# Altium project PokerFaceTestBoard.PrjPcb
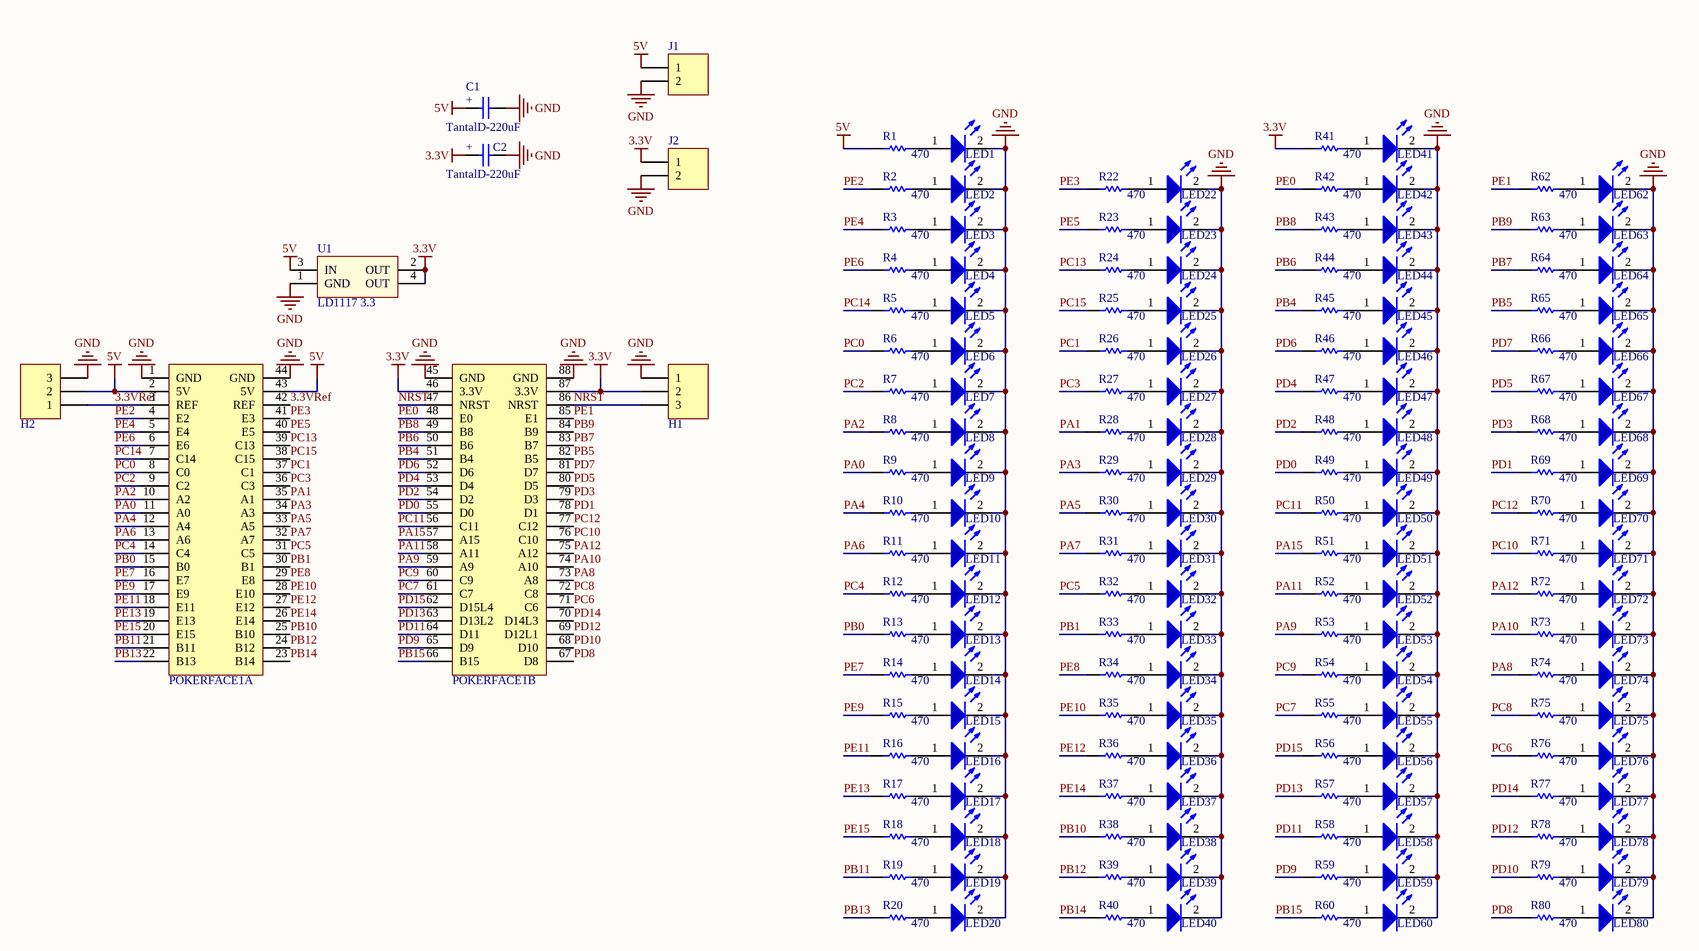
[diagram p0: PokerFaceTestBoard.SchDoc]
1 sheet, 164 parts. Net scope: global (net labels, ports and power ports of the same name join across sheets).
Board file: PokerFaceTestBoard.PcbDoc

## Sheet PokerFaceTestBoard.SchDoc
size A3

### Parts
C1  TantalD-220uF  [MY_CAP_SMD-D]
C2  TantalD-220uF  [MY_CAP_SMD-D]
H1  WE-2.54 mm Pin Header & Jumper 61300311121  [61300311121]  (value not drawn)
H2  WE-2.54 mm Pin Header & Jumper 61300311121  [61300311121]  (value not drawn)
J1  691312510002  [691312510002]  (value not drawn)
J2  691312510002  [691312510002]  (value not drawn)
LED1  150080BS75000  [LED_0805_Blue]  (value not drawn)
LED2  150080BS75000  [LED_0805_Blue]  (value not drawn)
LED3  150080BS75000  [LED_0805_Blue]  (value not drawn)
LED4  150080BS75000  [LED_0805_Blue]  (value not drawn)
LED5  150080BS75000  [LED_0805_Blue]  (value not drawn)
LED6  150080BS75000  [LED_0805_Blue]  (value not drawn)
LED7  150080BS75000  [LED_0805_Blue]  (value not drawn)
LED8  150080BS75000  [LED_0805_Blue]  (value not drawn)
LED9  150080BS75000  [LED_0805_Blue]  (value not drawn)
LED10  150080BS75000  [LED_0805_Blue]  (value not drawn)
LED11  150080BS75000  [LED_0805_Blue]  (value not drawn)
LED12  150080BS75000  [LED_0805_Blue]  (value not drawn)
LED13  150080BS75000  [LED_0805_Blue]  (value not drawn)
LED14  150080BS75000  [LED_0805_Blue]  (value not drawn)
LED15  150080BS75000  [LED_0805_Blue]  (value not drawn)
LED16  150080BS75000  [LED_0805_Blue]  (value not drawn)
LED17  150080BS75000  [LED_0805_Blue]  (value not drawn)
LED18  150080BS75000  [LED_0805_Blue]  (value not drawn)
LED19  150080BS75000  [LED_0805_Blue]  (value not drawn)
LED20  150080BS75000  [LED_0805_Blue]  (value not drawn)
LED22  150080BS75000  [LED_0805_Blue]  (value not drawn)
LED23  150080BS75000  [LED_0805_Blue]  (value not drawn)
LED24  150080BS75000  [LED_0805_Blue]  (value not drawn)
LED25  150080BS75000  [LED_0805_Blue]  (value not drawn)
LED26  150080BS75000  [LED_0805_Blue]  (value not drawn)
LED27  150080BS75000  [LED_0805_Blue]  (value not drawn)
LED28  150080BS75000  [LED_0805_Blue]  (value not drawn)
LED29  150080BS75000  [LED_0805_Blue]  (value not drawn)
LED30  150080BS75000  [LED_0805_Blue]  (value not drawn)
LED31  150080BS75000  [LED_0805_Blue]  (value not drawn)
LED32  150080BS75000  [LED_0805_Blue]  (value not drawn)
LED33  150080BS75000  [LED_0805_Blue]  (value not drawn)
LED34  150080BS75000  [LED_0805_Blue]  (value not drawn)
LED35  150080BS75000  [LED_0805_Blue]  (value not drawn)
LED36  150080BS75000  [LED_0805_Blue]  (value not drawn)
LED37  150080BS75000  [LED_0805_Blue]  (value not drawn)
LED38  150080BS75000  [LED_0805_Blue]  (value not drawn)
LED39  150080BS75000  [LED_0805_Blue]  (value not drawn)
LED40  150080BS75000  [LED_0805_Blue]  (value not drawn)
LED41  150080BS75000  [LED_0805_Blue]  (value not drawn)
LED42  150080BS75000  [LED_0805_Blue]  (value not drawn)
LED43  150080BS75000  [LED_0805_Blue]  (value not drawn)
LED44  150080BS75000  [LED_0805_Blue]  (value not drawn)
LED45  150080BS75000  [LED_0805_Blue]  (value not drawn)
LED46  150080BS75000  [LED_0805_Blue]  (value not drawn)
LED47  150080BS75000  [LED_0805_Blue]  (value not drawn)
LED48  150080BS75000  [LED_0805_Blue]  (value not drawn)
LED49  150080BS75000  [LED_0805_Blue]  (value not drawn)
LED50  150080BS75000  [LED_0805_Blue]  (value not drawn)
LED51  150080BS75000  [LED_0805_Blue]  (value not drawn)
LED52  150080BS75000  [LED_0805_Blue]  (value not drawn)
LED53  150080BS75000  [LED_0805_Blue]  (value not drawn)
LED54  150080BS75000  [LED_0805_Blue]  (value not drawn)
LED55  150080BS75000  [LED_0805_Blue]  (value not drawn)
LED56  150080BS75000  [LED_0805_Blue]  (value not drawn)
LED57  150080BS75000  [LED_0805_Blue]  (value not drawn)
LED58  150080BS75000  [LED_0805_Blue]  (value not drawn)
LED59  150080BS75000  [LED_0805_Blue]  (value not drawn)
LED60  150080BS75000  [LED_0805_Blue]  (value not drawn)
LED62  150080BS75000  [LED_0805_Blue]  (value not drawn)
LED63  150080BS75000  [LED_0805_Blue]  (value not drawn)
LED64  150080BS75000  [LED_0805_Blue]  (value not drawn)
LED65  150080BS75000  [LED_0805_Blue]  (value not drawn)
LED66  150080BS75000  [LED_0805_Blue]  (value not drawn)
LED67  150080BS75000  [LED_0805_Blue]  (value not drawn)
LED68  150080BS75000  [LED_0805_Blue]  (value not drawn)
LED69  150080BS75000  [LED_0805_Blue]  (value not drawn)
LED70  150080BS75000  [LED_0805_Blue]  (value not drawn)
LED71  150080BS75000  [LED_0805_Blue]  (value not drawn)
LED72  150080BS75000  [LED_0805_Blue]  (value not drawn)
LED73  150080BS75000  [LED_0805_Blue]  (value not drawn)
LED74  150080BS75000  [LED_0805_Blue]  (value not drawn)
LED75  150080BS75000  [LED_0805_Blue]  (value not drawn)
LED76  150080BS75000  [LED_0805_Blue]  (value not drawn)
LED77  150080BS75000  [LED_0805_Blue]  (value not drawn)
LED78  150080BS75000  [LED_0805_Blue]  (value not drawn)
LED79  150080BS75000  [LED_0805_Blue]  (value not drawn)
LED80  150080BS75000  [LED_0805_Blue]  (value not drawn)
POKERFACE1  POKERFACEV1-1  [PokerFaceV1-1]  (value not drawn)  (parts A,B of 2)
R1  470  [SMD 805]
R2  470  [SMD 805]
R3  470  [SMD 805]
R4  470  [SMD 805]
R5  470  [SMD 805]
R6  470  [SMD 805]
R7  470  [SMD 805]
R8  470  [SMD 805]
R9  470  [SMD 805]
R10  470  [SMD 805]
R11  470  [SMD 805]
R12  470  [SMD 805]
R13  470  [SMD 805]
R14  470  [SMD 805]
R15  470  [SMD 805]
R16  470  [SMD 805]
R17  470  [SMD 805]
R18  470  [SMD 805]
R19  470  [SMD 805]
R20  470  [SMD 805]
R22  470  [SMD 805]
R23  470  [SMD 805]
R24  470  [SMD 805]
R25  470  [SMD 805]
R26  470  [SMD 805]
R27  470  [SMD 805]
R28  470  [SMD 805]
R29  470  [SMD 805]
R30  470  [SMD 805]
R31  470  [SMD 805]
R32  470  [SMD 805]
R33  470  [SMD 805]
R34  470  [SMD 805]
R35  470  [SMD 805]
R36  470  [SMD 805]
R37  470  [SMD 805]
R38  470  [SMD 805]
R39  470  [SMD 805]
R40  470  [SMD 805]
R41  470  [SMD 805]
R42  470  [SMD 805]
R43  470  [SMD 805]
R44  470  [SMD 805]
R45  470  [SMD 805]
R46  470  [SMD 805]
R47  470  [SMD 805]
R48  470  [SMD 805]
R49  470  [SMD 805]
R50  470  [SMD 805]
R51  470  [SMD 805]
R52  470  [SMD 805]
R53  470  [SMD 805]
R54  470  [SMD 805]
R55  470  [SMD 805]
R56  470  [SMD 805]
R57  470  [SMD 805]
R58  470  [SMD 805]
R59  470  [SMD 805]
R60  470  [SMD 805]
R62  470  [SMD 805]
R63  470  [SMD 805]
R64  470  [SMD 805]
R65  470  [SMD 805]
R66  470  [SMD 805]
R67  470  [SMD 805]
R68  470  [SMD 805]
R69  470  [SMD 805]
R70  470  [SMD 805]
R71  470  [SMD 805]
R72  470  [SMD 805]
R73  470  [SMD 805]
R74  470  [SMD 805]
R75  470  [SMD 805]
R76  470  [SMD 805]
R77  470  [SMD 805]
R78  470  [SMD 805]
R79  470  [SMD 805]
R80  470  [SMD 805]
U1  LD1117 3.3  [MY_LD1117-3.3]

### Nets
3.3V: C2.+ H1.2 J2.1 POKERFACE1.46(3.3V) POKERFACE1.87(3.3V) R41.1 U1.2(OUT) U1.4(OUT)
5V: C1.+ H2.2 J1.1 POKERFACE1.2(5V) POKERFACE1.43(5V) R1.1 U1.3(IN)
GND: C1.- C2.- H1.1 H2.3 J1.2 J2.2 LED1.2(C) LED2.2(C) LED3.2(C) LED4.2(C) LED5.2(C) LED6.2(C) LED7.2(C) LED8.2(C) LED9.2(C) LED10.2(C) LED11.2(C) LED12.2(C) LED13.2(C) LED14.2(C) LED15.2(C) LED16.2(C) LED17.2(C) LED18.2(C) LED19.2(C) LED20.2(C) LED22.2(C) LED23.2(C) LED24.2(C) LED25.2(C) LED26.2(C) LED27.2(C) LED28.2(C) LED29.2(C) LED30.2(C) LED31.2(C) LED32.2(C) LED33.2(C) LED34.2(C) LED35.2(C) LED36.2(C) LED37.2(C) LED38.2(C) LED39.2(C) LED40.2(C) LED41.2(C) LED42.2(C) LED43.2(C) LED44.2(C) LED45.2(C) LED46.2(C) LED47.2(C) LED48.2(C) LED49.2(C) LED50.2(C) LED51.2(C) LED52.2(C) LED53.2(C) LED54.2(C) LED55.2(C) LED56.2(C) LED57.2(C) LED58.2(C) LED59.2(C) LED60.2(C) LED62.2(C) LED63.2(C) LED64.2(C) LED65.2(C) LED66.2(C) LED67.2(C) LED68.2(C) LED69.2(C) LED70.2(C) LED71.2(C) LED72.2(C) LED73.2(C) LED74.2(C) LED75.2(C) LED76.2(C) LED77.2(C) LED78.2(C) LED79.2(C) LED80.2(C) POKERFACE1.1(GND) POKERFACE1.44(GND) POKERFACE1.45(GND) POKERFACE1.88(GND) U1.1(GND)
3.3VRef: H2.1 POKERFACE1.3(REF) POKERFACE1.42(REF)
NRST: H1.3 POKERFACE1.47(NRST) POKERFACE1.86(NRST)
PA0: POKERFACE1.11(A0) R9.1
PA1: POKERFACE1.35(A1) R28.1
PA2: POKERFACE1.10(A2) R8.1
PA3: POKERFACE1.34(A3) R29.1
PA4: POKERFACE1.12(A4) R10.1
PA5: POKERFACE1.33(A5) R30.1
PA6: POKERFACE1.13(A6) R11.1
PA7: POKERFACE1.32(A7) R31.1
PA8: POKERFACE1.73(A8) R74.1
PA9: POKERFACE1.59(A9) R53.1
PA10: POKERFACE1.74(A10) R73.1
PA11: POKERFACE1.58(A11) R52.1
PA12: POKERFACE1.75(A12) R72.1
PA15: POKERFACE1.57(A15) R51.1
PB0: POKERFACE1.15(B0) R13.1
PB1: POKERFACE1.30(B1) R33.1
PB4: POKERFACE1.51(B4) R45.1
PB5: POKERFACE1.82(B5) R65.1
PB6: POKERFACE1.50(B6) R44.1
PB7: POKERFACE1.83(B7) R64.1
PB8: POKERFACE1.49(B8) R43.1
PB9: POKERFACE1.84(B9) R63.1
PB10: POKERFACE1.25(B10) R38.1
PB11: POKERFACE1.21(B11) R19.1
PB12: POKERFACE1.24(B12) R39.1
PB13: POKERFACE1.22(B13) R20.1
PB14: POKERFACE1.23(B14) R40.1
PB15: POKERFACE1.66(B15) R60.1
PC0: POKERFACE1.8(C0) R6.1
PC1: POKERFACE1.37(C1) R26.1
PC2: POKERFACE1.9(C2) R7.1
PC3: POKERFACE1.36(C3) R27.1
PC4: POKERFACE1.14(C4) R12.1
PC5: POKERFACE1.31(C5) R32.1
PC6: POKERFACE1.71(C6) R76.1
PC7: POKERFACE1.61(C7) R55.1
PC8: POKERFACE1.72(C8) R75.1
PC9: POKERFACE1.60(C9) R54.1
PC10: POKERFACE1.76(C10) R71.1
PC11: POKERFACE1.56(C11) R50.1
PC12: POKERFACE1.77(C12) R70.1
PC13: POKERFACE1.39(C13) R24.1
PC14: POKERFACE1.7(C14) R5.1
PC15: POKERFACE1.38(C15) R25.1
PD0: POKERFACE1.55(D0) R49.1
PD1: POKERFACE1.78(D1) R69.1
PD2: POKERFACE1.54(D2) R48.1
PD3: POKERFACE1.79(D3) R68.1
PD4: POKERFACE1.53(D4) R47.1
PD5: POKERFACE1.80(D5) R67.1
PD6: POKERFACE1.52(D6) R46.1
PD7: POKERFACE1.81(D7) R66.1
PD8: POKERFACE1.67(D8) R80.1
PD9: POKERFACE1.65(D9) R59.1
PD10: POKERFACE1.68(D10) R79.1
PD11: POKERFACE1.64(D11) R58.1
PD12: POKERFACE1.69(D12L1) R78.1
PD13: POKERFACE1.63(D13L2) R57.1
PD14: POKERFACE1.70(D14L3) R77.1
PD15: POKERFACE1.62(D15L4) R56.1
PE0: POKERFACE1.48(E0) R42.1
PE1: POKERFACE1.85(E1) R62.1
PE2: POKERFACE1.4(E2) R2.1
PE3: POKERFACE1.41(E3) R22.1
PE4: POKERFACE1.5(E4) R3.1
PE5: POKERFACE1.40(E5) R23.1
PE6: POKERFACE1.6(E6) R4.1
PE7: POKERFACE1.16(E7) R14.1
PE8: POKERFACE1.29(E8) R34.1
PE9: POKERFACE1.17(E9) R15.1
PE10: POKERFACE1.28(E10) R35.1
PE11: POKERFACE1.18(E11) R16.1
PE12: POKERFACE1.27(E12) R36.1
PE13: POKERFACE1.19(E13) R17.1
PE14: POKERFACE1.26(E14) R37.1
PE15: POKERFACE1.20(E15) R18.1
NetLED1_1: LED1.1(A) R1.2
NetLED2_1: LED2.1(A) R2.2
NetLED3_1: LED3.1(A) R3.2
NetLED4_1: LED4.1(A) R4.2
NetLED5_1: LED5.1(A) R5.2
NetLED6_1: LED6.1(A) R6.2
NetLED7_1: LED7.1(A) R7.2
NetLED8_1: LED8.1(A) R8.2
NetLED9_1: LED9.1(A) R9.2
NetLED10_1: LED10.1(A) R10.2
NetLED11_1: LED11.1(A) R11.2
NetLED12_1: LED12.1(A) R12.2
NetLED13_1: LED13.1(A) R13.2
NetLED14_1: LED14.1(A) R14.2
NetLED15_1: LED15.1(A) R15.2
NetLED16_1: LED16.1(A) R16.2
NetLED17_1: LED17.1(A) R17.2
NetLED18_1: LED18.1(A) R18.2
NetLED19_1: LED19.1(A) R19.2
NetLED20_1: LED20.1(A) R20.2
NetLED22_1: LED22.1(A) R22.2
NetLED23_1: LED23.1(A) R23.2
NetLED24_1: LED24.1(A) R24.2
NetLED25_1: LED25.1(A) R25.2
NetLED26_1: LED26.1(A) R26.2
NetLED27_1: LED27.1(A) R27.2
NetLED28_1: LED28.1(A) R28.2
NetLED29_1: LED29.1(A) R29.2
NetLED30_1: LED30.1(A) R30.2
NetLED31_1: LED31.1(A) R31.2
NetLED32_1: LED32.1(A) R32.2
NetLED33_1: LED33.1(A) R33.2
NetLED34_1: LED34.1(A) R34.2
NetLED35_1: LED35.1(A) R35.2
NetLED36_1: LED36.1(A) R36.2
NetLED37_1: LED37.1(A) R37.2
NetLED38_1: LED38.1(A) R38.2
NetLED39_1: LED39.1(A) R39.2
NetLED40_1: LED40.1(A) R40.2
NetLED41_1: LED41.1(A) R41.2
NetLED42_1: LED42.1(A) R42.2
NetLED43_1: LED43.1(A) R43.2
NetLED44_1: LED44.1(A) R44.2
NetLED45_1: LED45.1(A) R45.2
NetLED46_1: LED46.1(A) R46.2
NetLED47_1: LED47.1(A) R47.2
NetLED48_1: LED48.1(A) R48.2
NetLED49_1: LED49.1(A) R49.2
NetLED50_1: LED50.1(A) R50.2
NetLED51_1: LED51.1(A) R51.2
NetLED52_1: LED52.1(A) R52.2
NetLED53_1: LED53.1(A) R53.2
NetLED54_1: LED54.1(A) R54.2
NetLED55_1: LED55.1(A) R55.2
NetLED56_1: LED56.1(A) R56.2
NetLED57_1: LED57.1(A) R57.2
NetLED58_1: LED58.1(A) R58.2
NetLED59_1: LED59.1(A) R59.2
NetLED60_1: LED60.1(A) R60.2
NetLED62_1: LED62.1(A) R62.2
NetLED63_1: LED63.1(A) R63.2
NetLED64_1: LED64.1(A) R64.2
NetLED65_1: LED65.1(A) R65.2
NetLED66_1: LED66.1(A) R66.2
NetLED67_1: LED67.1(A) R67.2
NetLED68_1: LED68.1(A) R68.2
NetLED69_1: LED69.1(A) R69.2
NetLED70_1: LED70.1(A) R70.2
NetLED71_1: LED71.1(A) R71.2
NetLED72_1: LED72.1(A) R72.2
NetLED73_1: LED73.1(A) R73.2
NetLED74_1: LED74.1(A) R74.2
NetLED75_1: LED75.1(A) R75.2
NetLED76_1: LED76.1(A) R76.2
NetLED77_1: LED77.1(A) R77.2
NetLED78_1: LED78.1(A) R78.2
NetLED79_1: LED79.1(A) R79.2
NetLED80_1: LED80.1(A) R80.2

### Library data of the parts
C1 C2 = CAP_TANTAL_D: 7.3X4.3MM; Value: 3300u
H1 H2 = WE-2.54 mm Pin Header & Jumper 61300311121: WR-PHD 2.54mm Pin Header; Manufacturer: W¨¹rth Elektronik eiSos GmbH; ComponentLink1 Description: Manufacturer; ComponentLink2 Description: Datasheet; NoPins: 03; Created Date: 22 March 2013; partNo: 61300311121; ComponentLink1URL: http://www.we-online.com; ComponentLink2URL: http://katalog.we-online.de/em/datasheet/6130xx11121.pdf; Created by: Karrer Zheng
J1 J2 = 691312510002: WR-TBL Terminal Blocks Serie 312 – 5.08 mm; Manufacturer: Würth Elektronik eiSos GmbH; ComponentLink1 Description: Manufacturer; ComponentLink2 Description: Datasheet; NoPins: 02; Created Date: 31 March 2014; partNo: 691312510002; ComponentLink1URL: http://www.we-online.com; ComponentLink2URL: http://katalog.we-online.de/em/datasheet/6913125100xx.pdf; Created by: Karrer Zheng
LED1-LED20 LED22-LED60 LED62-LED80 = WL-SMCW 0805  150080BS75000: SMD mono-color Chip LED, WL-SMCW, Blue; Manufacturer: W黵th Elektronik eiSos GmbH; PartNo: 150080BS75000; ComponentLink1Description: Manufacturer; ComponentLink1URL: http://www.we-online.de; Created by: Christin Otto; Created Date: June 2013; ComponentLink2Description: Datasheet; ComponentLink2URL: http://katalog.we-online.com/led/datasheet/150080BS75000.pdf; Color: Blue
R1-R20 R22-R60 R62-R80 = Resistor